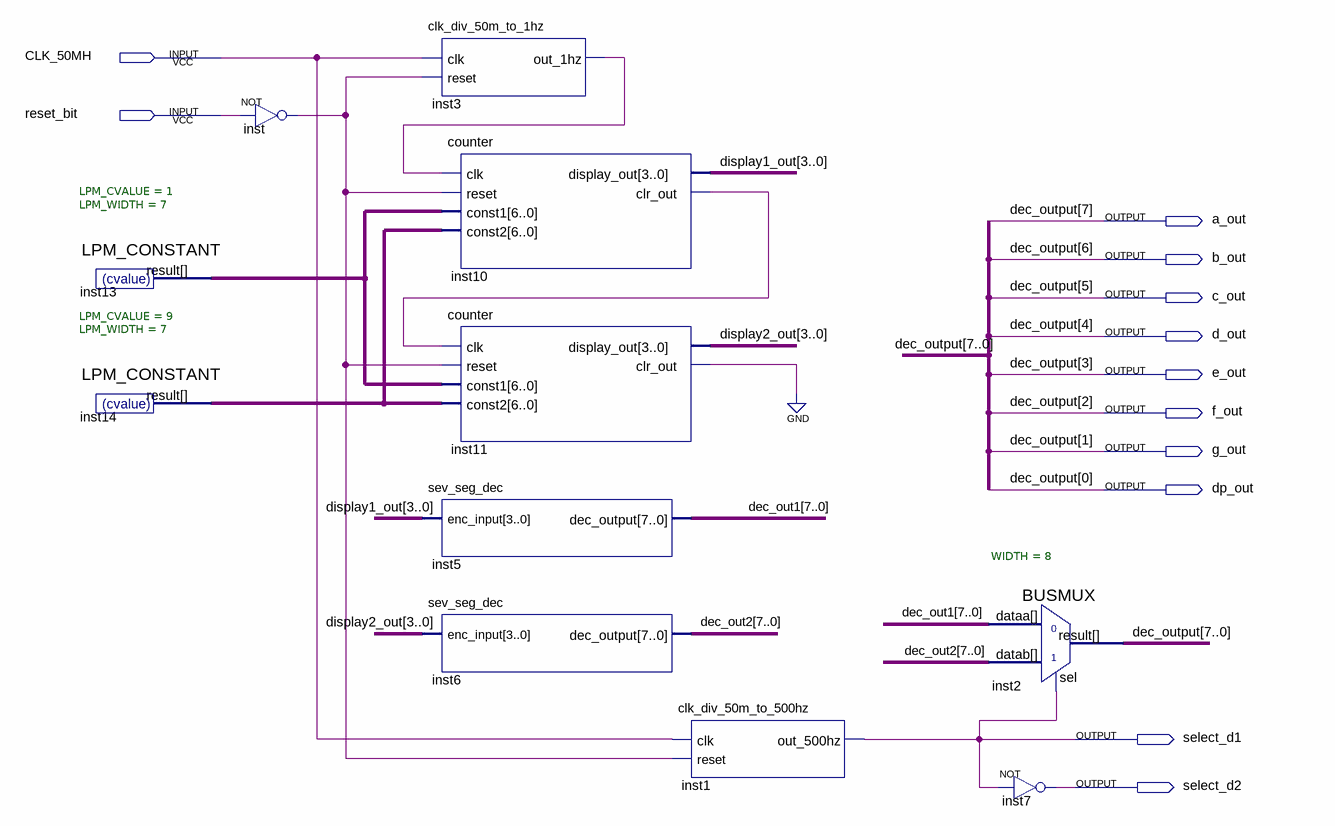
[diagram p0: schematic sheet]
// Quartus schematic full_scheme.bdf as structural Verilog: 11 symbols, 12 pins
module full_scheme (
  input  CLK_50MH,
  input  reset_bit,
  output a_out,
  output b_out,
  output c_out,
  output d_out,
  output e_out,
  output f_out,
  output g_out,
  output dp_out,
  output select_d1,
  output select_d2
);

  wire inst3_out_1hz, inst10_clr_out, inst11_clr_out, inst_out;
  wire [3:0] display1_out, display2_out;
  wire [6:0] inst13_result, inst14_result;
  wire [7:0] dec_out1, dec_out2;

  LPM_CONSTANT #(.LPM_CVALUE(1), .LPM_WIDTH(7)) inst13 (.result(inst13_result));
  LPM_CONSTANT #(.LPM_CVALUE(9), .LPM_WIDTH(7)) inst14 (.result(inst14_result));
  not inst (inst_out, reset_bit);
  clk_div_50m_to_1hz inst3 (.clk(CLK_50MH), .reset(inst_out), .out_1hz(inst3_out_1hz));
  counter inst10 (
    .clk(inst3_out_1hz), .reset(inst_out), .const1(inst13_result), .const2(inst14_result),
    .display_out(display1_out), .clr_out(inst10_clr_out));
  counter inst11 (
    .clk(inst10_clr_out), .reset(inst_out), .const1(inst13_result), .const2(inst14_result),
    .display_out(display2_out), .clr_out(inst11_clr_out));
  sev_seg_dec inst5 (.enc_input(display1_out), .dec_output(dec_out1));
  sev_seg_dec inst6 (.enc_input(display2_out), .dec_output(dec_out2));
  clk_div_50m_to_500hz inst1 (.clk(CLK_50MH), .reset(inst_out), .out_500hz(select_d1));
  BUSMUX #(.WIDTH(8)) inst2 (
    .datab(dec_out2), .sel(select_d1), .dataa(dec_out1),
    .result({a_out, b_out, c_out, d_out, e_out, f_out, g_out, dp_out}));
  not inst7 (select_d2, select_d1);
  // also tied to GND on the sheet: inst11_clr_out

  // Other names for the same wires on the sheet: dec_output[7:0] = {a_out, b_out, c_out, d_out, e_out, f_out, g_out, dp_out}
endmodule
